# EasyEDA Pro project ProPrj_MSP_M0_G3507_扩展板_2025-09-12.epro, board PCB1
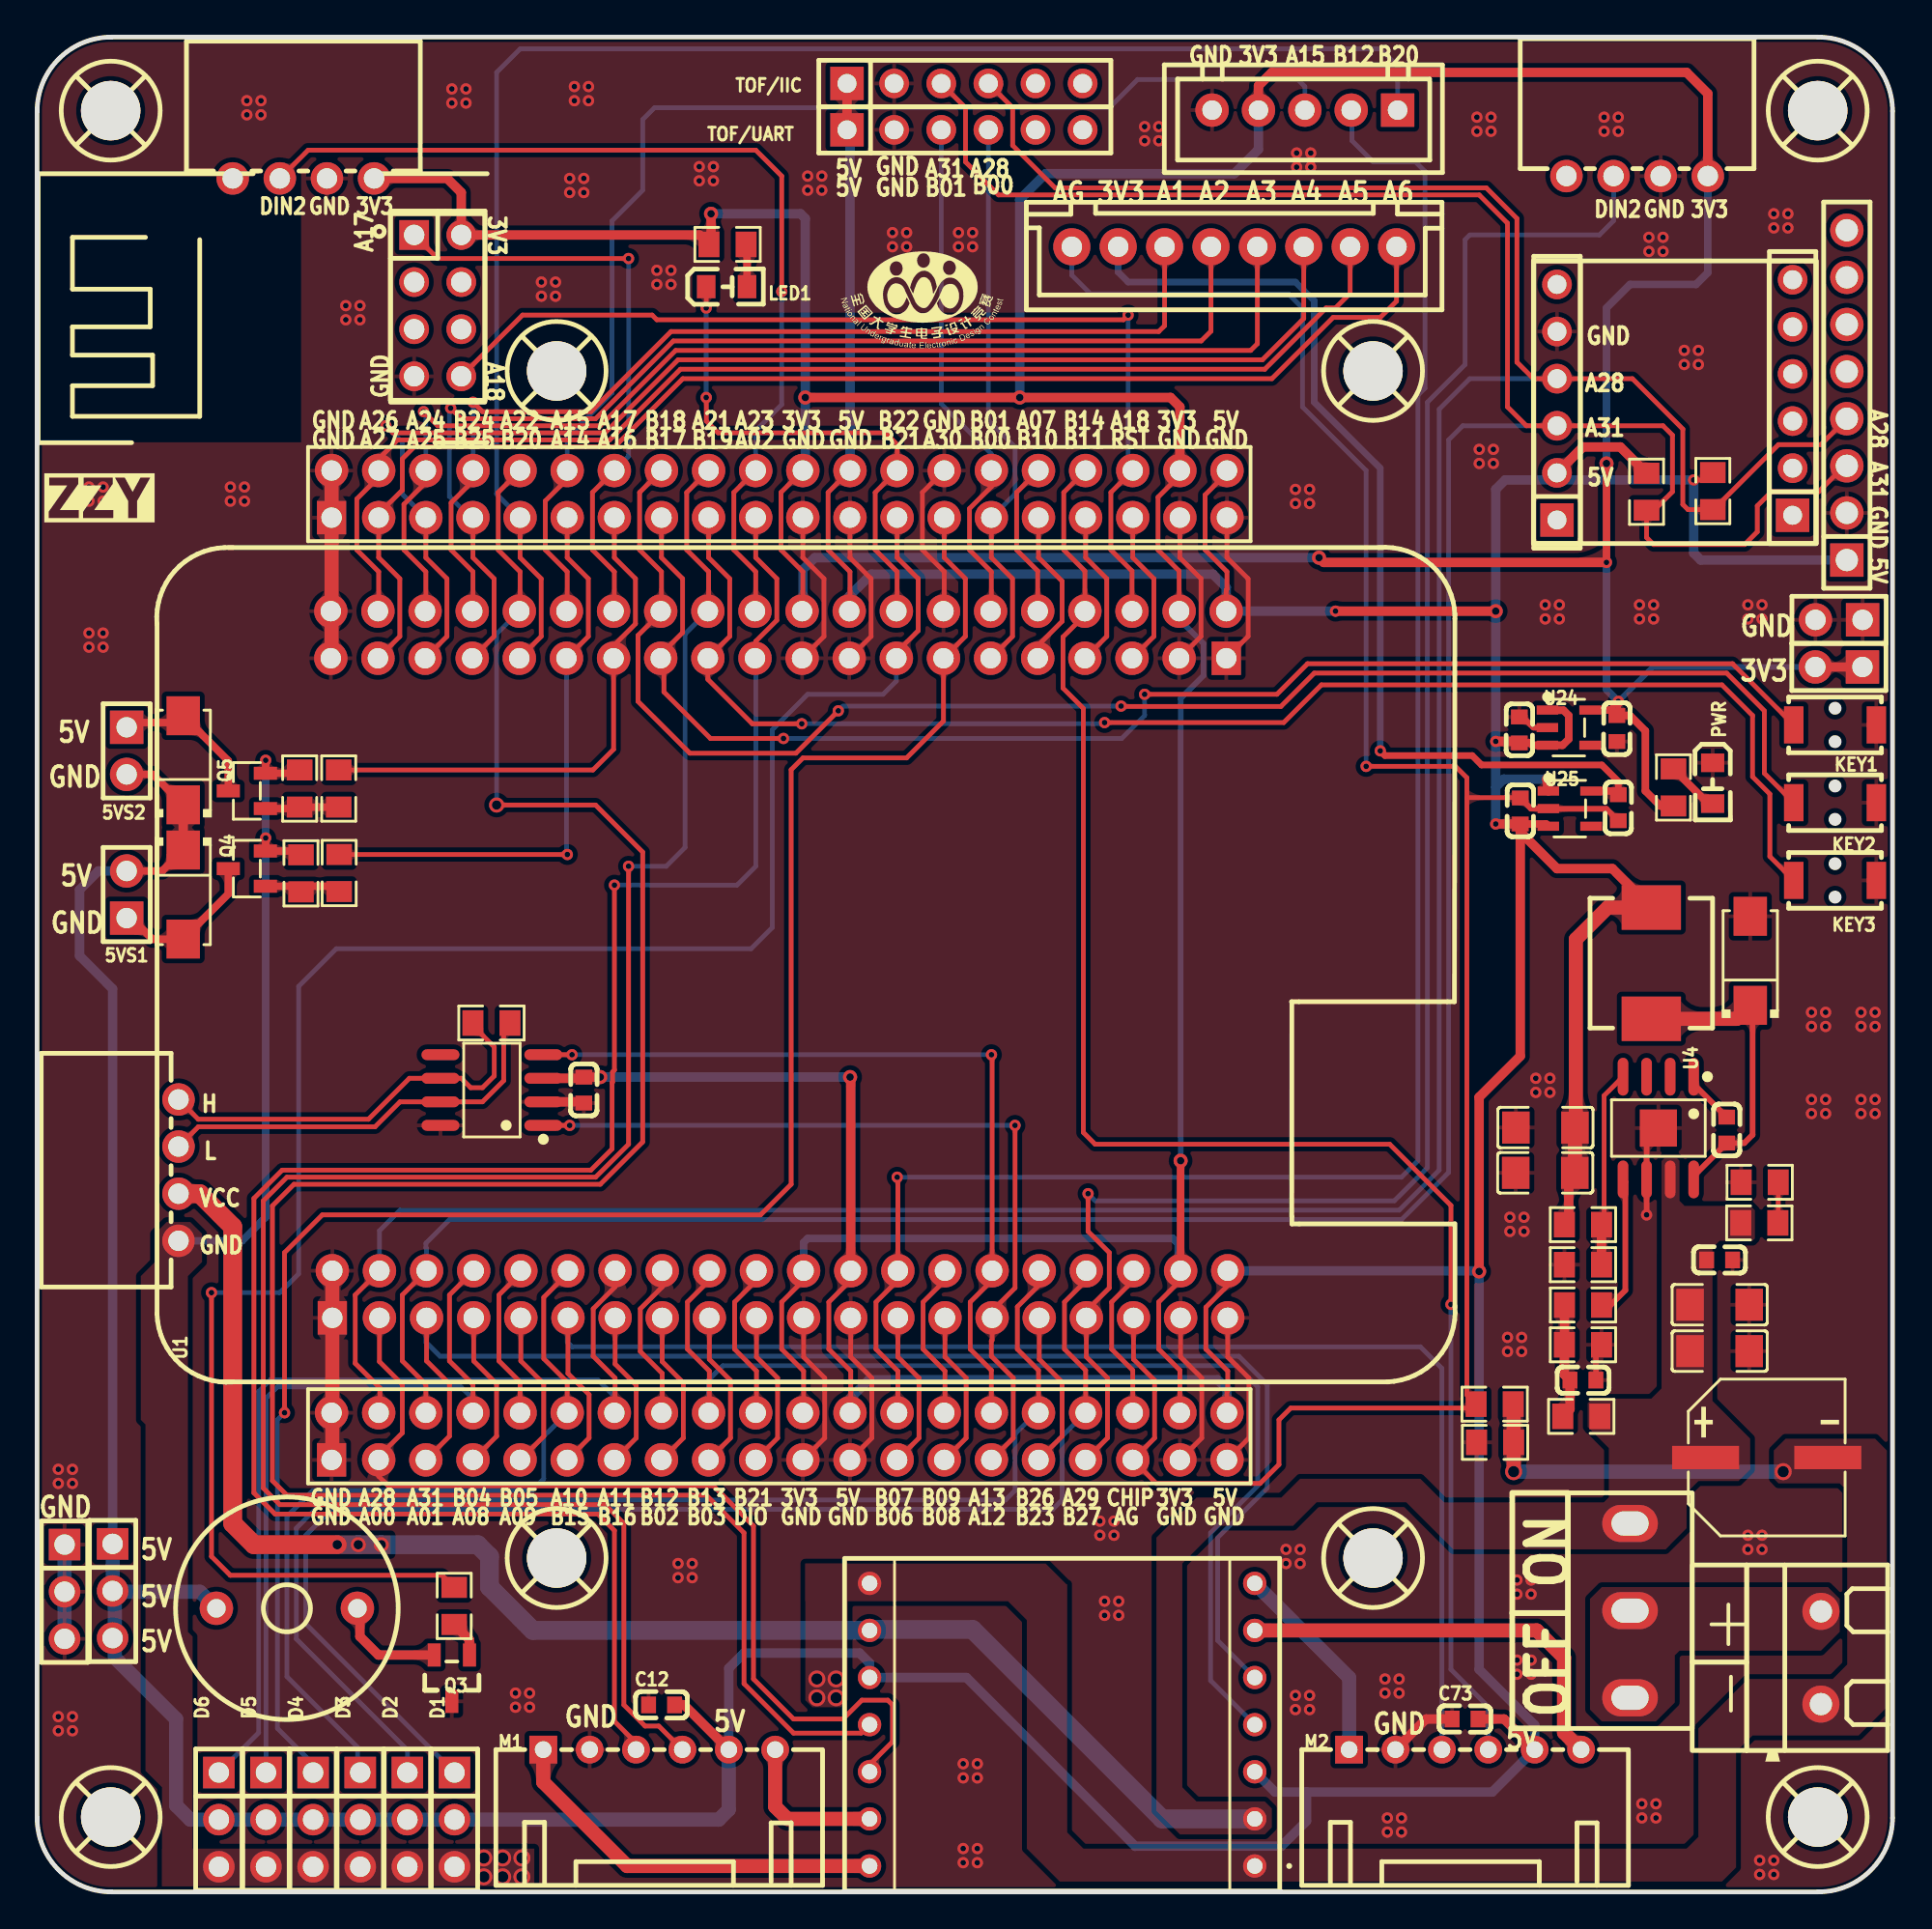
[diagram p4: board, top side]
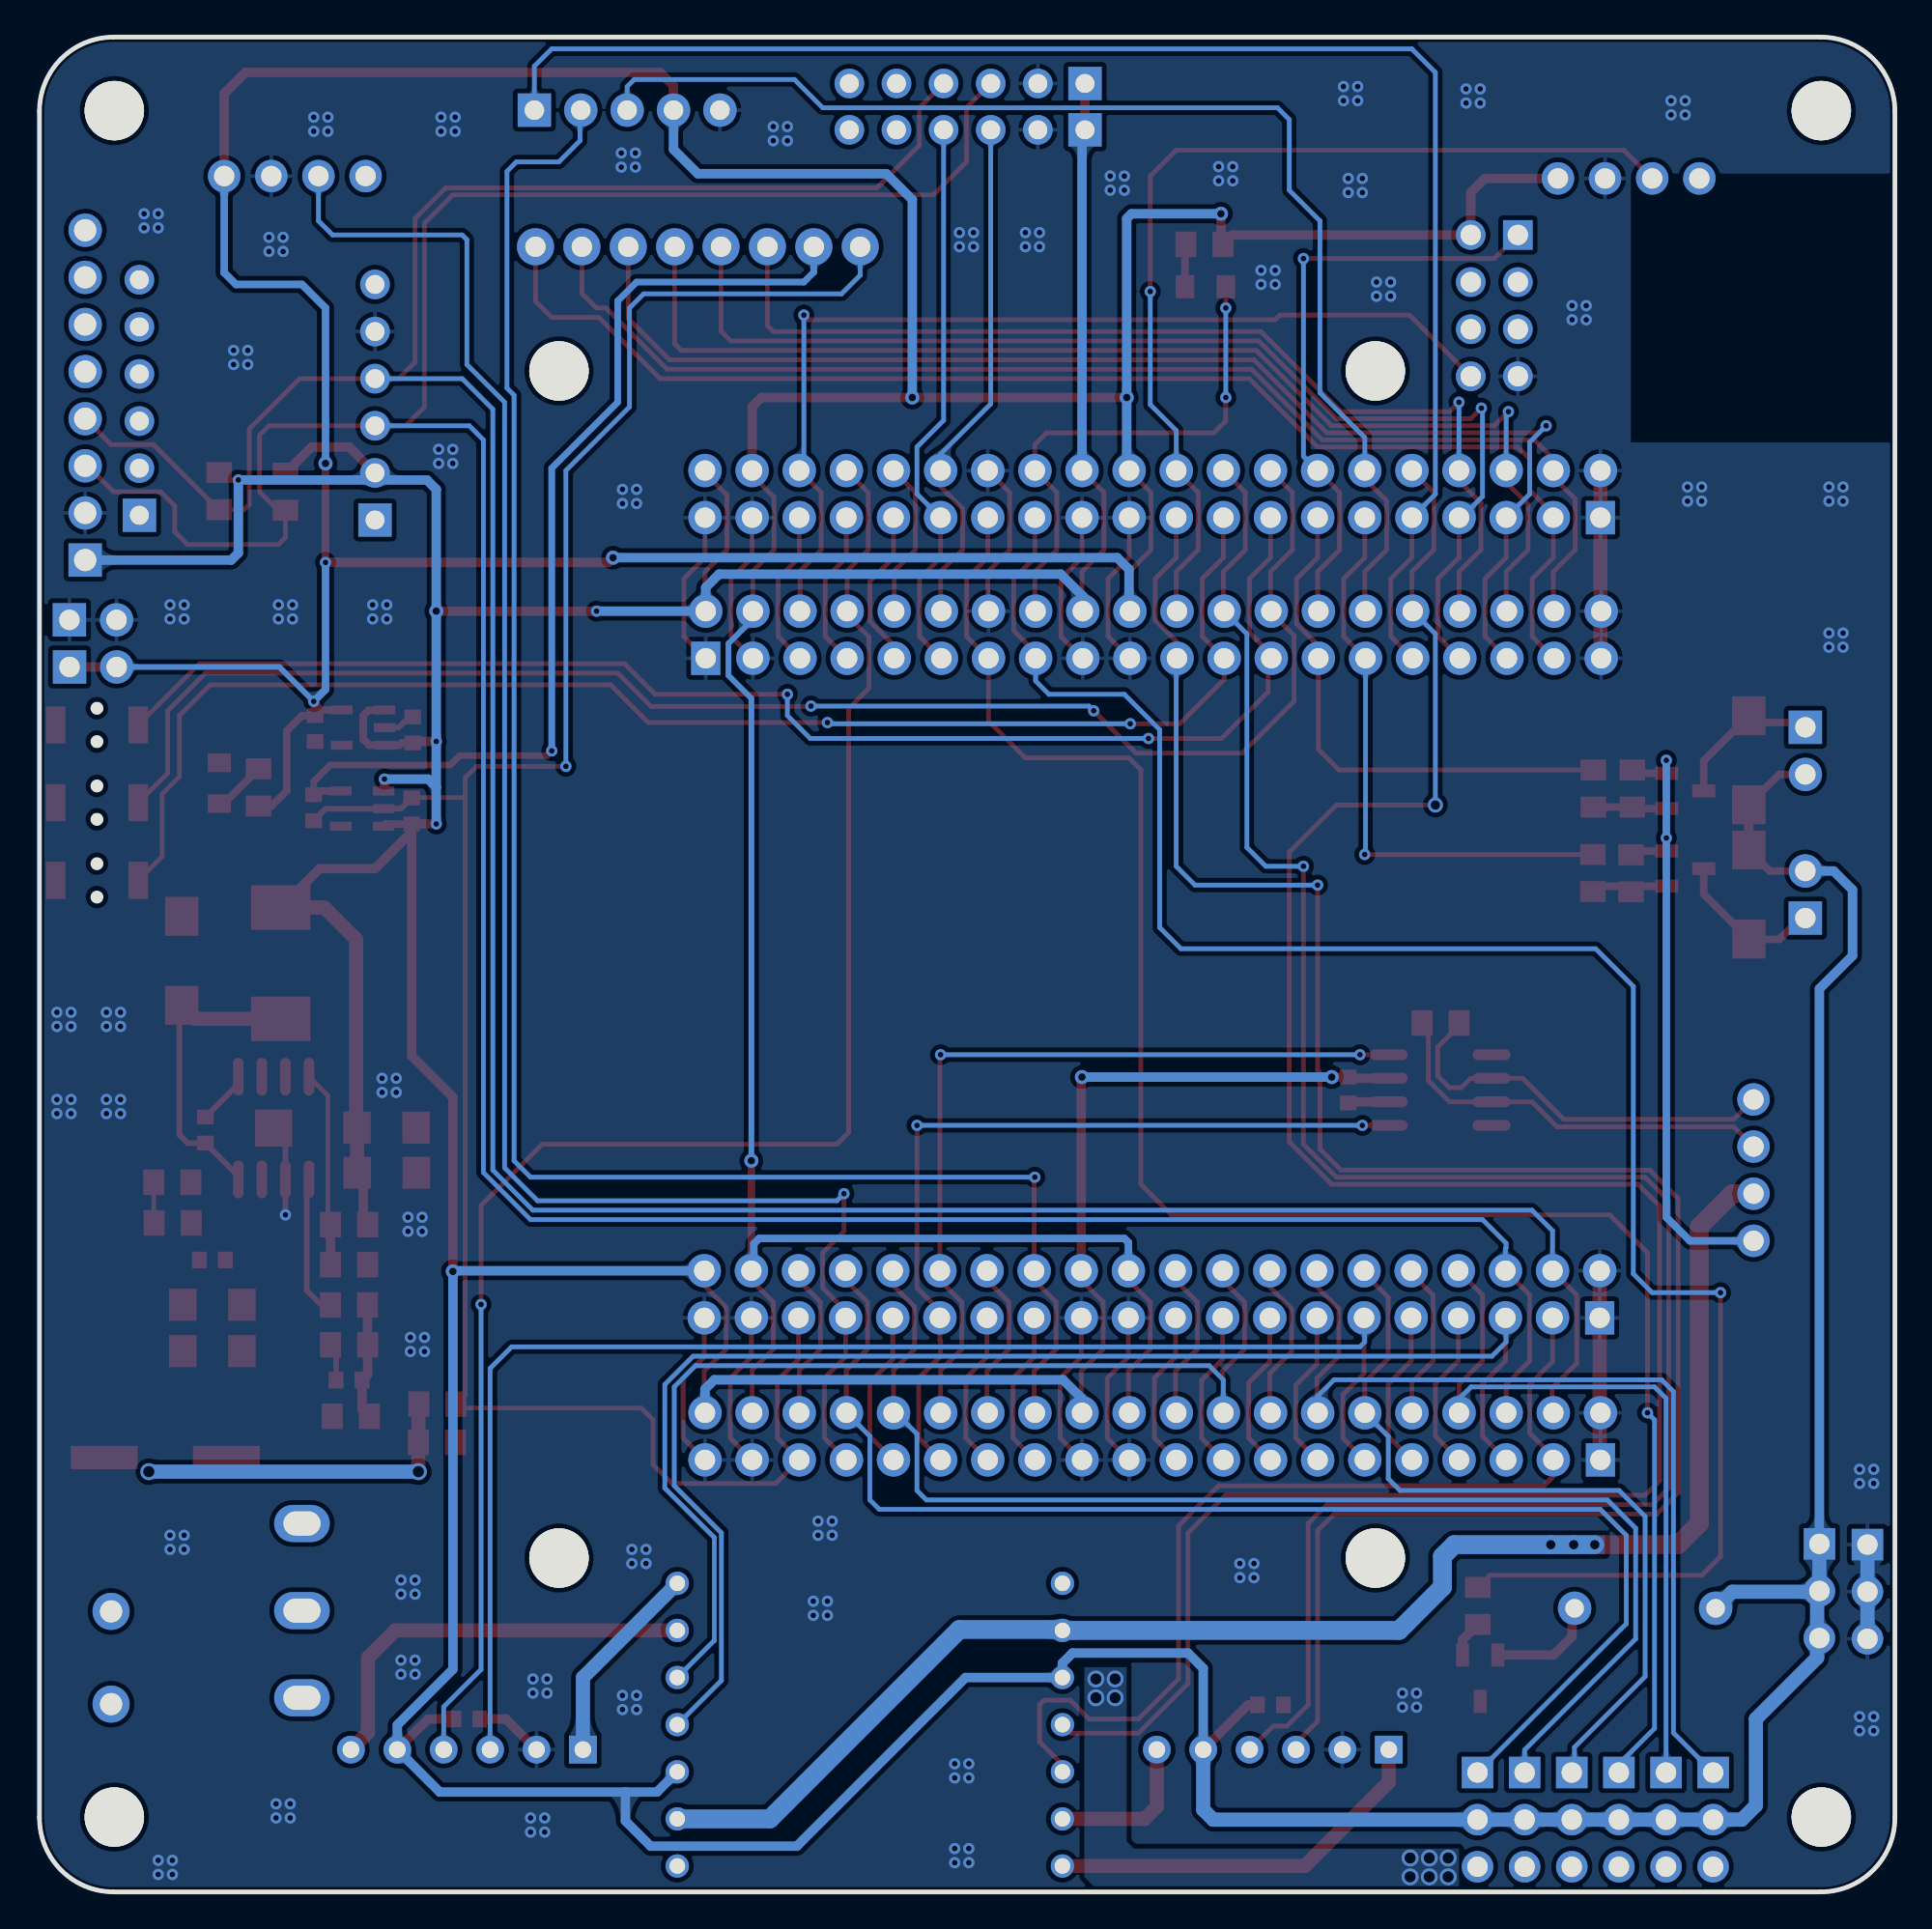
[diagram p5: board, bottom side, seen from below]

Outline 100 x 100 mm; copper layers: Top Layer, Bottom Layer. Coordinates in mm from the lower left corner of the outline.
Outline path: 0,96 0,4 arc(1.17,1.17) 4,0 96,0 arc(98.83,1.17) 100,4 100,96 arc(98.83,98.83) 96,100 4,100 arc(1.17,98.83) 0,96
Stack: Top Layer 0.035mm / Dielectric1 1.51mm FR4 er 4.5 / Bottom Layer 0.035mm

## Design rules (mm)
net CANL: DP1
net CANH: DP1
template: JLCPCB Capability(Two Layers Board)
spacing copperThickness1oz (default): track to track 0.102, other pairs 0.152 to 0.3
spacing copperThickness2oz: track to track 0.203, other pairs 0.152 to 0.3
track width copperThickness1oz (default): min 0.127, default 0.254, max 2.54
track width copperThickness2oz: min 0.203, default 0.254, max 2.54
differential pair differentialPair (default): width min 0.127, default 0.254, max 2.54; gap min 0.152, default 0.152
via viaSize (default): diameter min 0.5, default 0.61, max 10; hole min 0.3, default 0.305, max 6.3

## Placement (name value [footprint] x y rotation side)
5VS1  -  [HDR-TH_2P-P2.54-V-M-1]  4.83 53.77 90 top
5VS2  -  [HDR-TH_2P-P2.54-V-M-1]  4.83 61.52 270 top
BUZZER1  2.4kHz  [BUZ-TH_BD12.0-P7.60-D0.6-FD]  13.46 15.29 0 top
C3  220uF  [CAP-SMD_BD8.0-L8.3-W8.3-LS9.1-FD]  93.22 23.42 0 top
C4  4.7uF  [C0603]  90.68 34.07 0 top
C5  22uF  [C1206]  90.68 31.66 0 top
C6  47uF  [C1206]  90.68 29.16 0 top
C7  47uF  [C1206]  81.28 38.77 0 top
C8  22uF  [C1206]  81.29 41.21 0 top
C9  10nF  [C0603]  91.06 41.07 270 top
C12  100nF  [C0603]  33.66 10.08 0 top
C13  100NF  [C0603]  29.46 43.23 270 top
C32  100nF  [C0603]  83.31 27.59 180 top
C36  1uF  [C0603]  79.88 62.64 270 top
C37  1uF  [C0603]  85.14 62.72 90 top
C49  1uF  [C0603]  79.94 58.28 270 top
C50  1uF  [C0603]  85.22 58.45 90 top
C73  100nF  [C0603]  76.96 9.32 0 top
CN3  HWXJ  [CONN-TH_8P-P2.50-XH2.54-8P]  64.52 88.7 0 top
CN6  CAN  [CONN-TH_XH-4AW]  7.62 38.91 270 top
CN7  CCD  [CONN-TH_5P-P2.50_XH-5A]  68.33 96.06 180 top
CN9  L_DIN  [CONN-TH_XH-4AW]  14.35 92.38 180 top
CN10  R_DIN  [CONN-TH_XH-4AW]  86.23 92.51 180 top
D1  PZ254V-11-03P  [HDR-TH_3P-P2.54-V-M]  22.5 3.9 270 top
D2  PZ254V-11-03P  [HDR-TH_3P-P2.54-V-M]  19.95 3.9 270 top
D3  PZ254V-11-03P  [HDR-TH_3P-P2.54-V-M]  17.42 3.9 270 top
D4  PZ254V-11-03P  [HDR-TH_3P-P2.54-V-M]  14.88 3.9 270 top
D5  PZ254V-11-03P  [HDR-TH_3P-P2.54-V-M]  12.33 3.9 270 top
D6  PZ254V-11-03P  [HDR-TH_3P-P2.54-V-M]  9.8 3.9 270 top
ESP01S1  -  [HDR-TH_8P-P2.54-V-F-R2-C4-S2.54-1]  21.59 85.52 270 top
H6  -  [HDR-TH_6P-P2.54-V-F]  94.62 80.57 90 top
H20  -  [HDR-TH_8P-P2.54-V-F-1]  97.54 80.7 90 top
H21  -  [HDR-TH_3P-P2.54-V-M]  4.07 16.22 270 top
H22  -  [HDR-TH_2P-P2.54-V-M-1]  97.11 66.04 180 top
H24  -  [HDR-TH_2P-P2.54-V-M-1]  97.12 68.58 180 top
H25  -  [HDR-TH_3P-P2.54-V-M]  1.48 16.19 270 top
JY901I2C1  -  [HDR-TH_6P-P2.54-V-F]  81.91 80.31 90 top
KEY1  ZX-QC34-2TPDZ  [KEY-SMD_L3.9-W3.0-LS5.0-EH]  96.9 62.92 0 top
KEY2  ZX-QC34-2TPDZ  [KEY-SMD_L3.9-W3.0-LS5.0-EH]  96.9 58.72 0 top
KEY3  ZX-QC34-2TPDZ  [KEY-SMD_L3.9-W3.0-LS5.0-EH]  96.9 54.53 0 top
LED1  -  [LED_0805]  37.21 86.54 0 top
M1  ZX-HA2.54-6PWZ  [CONN-TH_6P-P2.50_ZX-HA2.54-6PWZ-Y]  33.53 7.67 0 top
M2  ZX-HA2.54-6PWZ  [CONN-TH_6P-P2.50_ZX-HA2.54-6PWZ-Y]  76.96 7.67 0 top
P1  KF301-2P接线端子  [CONN-TH_XY301V-A-5.0-2P]  96.14 12.62 270 top
PWR  -  [LED_0805]  90.3 59.72 270 top
Q3  -  [S8550P_SOT]  22.35 11.48 90 top
Q4  AO3400A  [SOT-23-3_L2.9-W1.3-P1.90-LS2.4-BR]  11.3 55.17 0 top
Q5  AO3400A  [SOT-23-3_L2.9-W1.3-P1.90-LS2.4-BR]  11.3 59.36 0 top
R1  10K  [R0805]  92.82 36.07 0 top
R5  1K  [R0805]  92.84 38.26 0 top
R6  10K  [R0805]  83.31 35.97 180 top
R7  3.3K  [R0805]  83.31 33.82 0 top
R8  120R  [R0805]  24.49 46.84 0 top
R16  6.8KNTC  [R0805]  83.31 29.5 180 top
R17  10K  [R0805]  83.22 25.64 0 top
R18  0R  [R0805]  83.32 31.64 0 top
R19  0R  [R0805]  78.58 24.24 0 top
R20  3.3K  [R0805]  86.74 75.49 90 top
R21  3.3K  [R0805]  90.31 75.52 90 top
R23  1K  [R0805]  22.48 15.42 270 top
R24  6.8K  [R0805]  88.19 59.55 270 top
R89  0R  [R0805]  78.56 26.3 0 top
R90  22R  [R0805]  16.28 54.93 90 top
R91  10K  [R0805]  14.22 54.92 90 top
R92  22R  [R0805]  16.26 59.49 90 top
R93  10K  [R0805]  14.15 59.49 90 top
R94  6.8K  [R0805]  37.21 88.82 180 top
SCREW1  -  [M3螺丝]  3.97 4.03 270 top
SCREW2  -  [M3螺丝]  95.97 96.03 270 top
SCREW3  -  [M3螺丝]  3.97 96.03 270 top
SCREW4  -  [M3螺丝]  95.97 4.03 270 top
SCREW5  -  [M3螺丝]  72 18 0 top
SCREW6  -  [M3螺丝]  72 82 0 top
SCREW7  -  [M3螺丝]  28 82 0 top
SCREW8  -  [M3螺丝]  28 18 0 top
SW1  SS-12D10L5  [SW-TH_SS-12D10L5]  85.85 15.16 90 top
TOF/IIC  -  [HDR-TH_6P-P2.54-V-F]  50 97.5 0 top
TOF/UART  -  [HDR-TH_6P-P2.54-V-F]  50 95 0 top
U1  LCKFB-TMX-MSPM0G3507  [COMM-TH_LCKFB-TMX-MSPM0G3507]  40 50 90 top
U4  RT8289GSP  [SOIC-8_L5.0-W4.0-P1.27-LS6.0-BL-EP2.0]  87.38 41.18 180 top
U5  TJA1050T  [SOIC-8_L4.9-W3.9-P1.27-LS6.0-BL]  24.51 43.23 90 top
U24  RT9013-33GB  [SOT-23-5_L3.0-W1.7-P0.95-LS2.8-BL]  82.55 62.77 270 top
U25  RT9013-33GB  [SOT-23-5_L3.0-W1.7-P0.95-LS2.8-BL]  82.6 58.4 270 top
U41  AT8236  [AT8236-Dual-Module]  55.25 9.07 180 top
U48  -  [jy901]  95.88 72.57 180 top
U50  -  [esp01s]  24.26 92.63 270 top
U51  10uH  [IND-SMD_L7.0-W6.6]  87 50.07 270 top
U52  SS54  [SMA_L4.2-W2.6-LS5.1-RD]  7.87 53.77 270 top
U53  SS54  [SMA_L4.2-W2.6-LS5.1-RD]  92.33 50.2 90 top
U54  SS54  [SMA_L4.2-W2.6-LS5.1-RD]  7.87 61.01 90 top
U55  left  [HDR-TH_40P-P2.54-V-M-R2-C20-S2.54]  40 24.56 0 top
U56  right  [HDR-TH_40P-P2.54-V-M-R2-C20-S2.54]  40 75.36 0 top

## Footprints (pads in the part's own frame, mm; a bottom-side part is the same pattern mirrored in y, then rotated)
AT8236-Dual-Module
  round 1.26 hole 0.84: 1(-10.38,7.671) 2(-10.38,5.131) 3(-10.38,2.591) 4(-10.38,0.051) 5(-10.38,-2.489) 6(-10.38,-5.029) 7(-10.38,-7.569) 8(10.38,7.671) 9(10.38,5.131) 10(10.38,2.591) 11(10.38,0.051) 12(10.38,-2.489) 13(10.38,-5.029) 14(10.38,-7.569)
BUZ-TH_BD12.0-P7.60-D0.6-FD
  round 1.8 hole 1: 1(-3.8,0) 2(3.8,0)
C0603
  rect 0.8x0.9 smd: 1(-0.7,0) 2(0.7,0)
C1206
  rect 1.485x1.728 smd: 1(-1.593,0) 2(1.593,0)
CAP-SMD_BD8.0-L8.3-W8.3-LS9.1-FD
  rect 3.61x1.26 smd: 1(-3.295,0) 2(3.295,0)
COMM-TH_LCKFB-TMX-MSPM0G3507
  rect 1.8x1.575 hole 1.1: 1(-19.05,24.09) 41(16.51,-24.09)
  round 1.8 hole 1.1: 2(-16.51,24.09) 3(-19.05,21.549) 4(-16.51,21.549) 5(-19.05,19.009) 6(-16.51,19.009) 7(-19.05,16.47) 8(-16.51,16.47) 9(-19.05,13.93) 10(-16.51,13.93) 11(-19.05,11.389) 12(-16.51,11.389) 13(-19.05,8.85) 14(-16.51,8.85) 15(-19.05,6.309) 16(-16.51,6.309) 17(-19.05,3.769) 18(-16.51,3.769) 19(-19.05,1.23) 20(-16.51,1.23) 21(-19.05,-1.31) 22(-16.51,-1.31) 23(-19.05,-3.85) 24(-16.51,-3.85) 25(-19.05,-6.391) 26(-16.51,-6.391) 27(-19.05,-8.931) 28(-16.51,-8.931) 29(-19.05,-11.47) 30(-16.51,-11.47) 31(-19.05,-14.011) 32(-16.51,-14.011) 33(-19.05,-16.55) 34(-16.51,-16.55) 35(-19.05,-19.09) 36(-16.51,-19.09) 37(-19.05,-21.631) 38(-16.51,-21.631) 39(-19.05,-24.171) 40(-16.51,-24.171) 42(19.05,-24.09) 43(16.51,-21.549) 44(19.05,-21.549) 45(16.51,-19.009) 46(19.05,-19.009) 47(16.51,-16.47) 48(19.05,-16.47) 49(16.51,-13.93) 50(19.05,-13.93) 51(16.51,-11.389) 52(19.05,-11.389) 53(16.51,-8.85) 54(19.05,-8.85) 55(16.51,-6.309) 56(19.05,-6.309) 57(16.51,-3.769) 58(19.05,-3.769) 59(16.51,-1.23) 60(19.05,-1.23) 61(16.51,1.31) 62(19.05,1.31) 63(16.51,3.85) 64(19.05,3.85) 65(16.51,6.391) 66(19.05,6.391) 67(16.51,8.931) 68(19.05,8.931) 69(16.51,11.47) 70(19.05,11.47) 71(16.51,14.011) 72(19.05,14.011) 73(16.51,16.55) 74(19.05,16.55) 75(16.51,19.09) 76(19.05,19.09) 77(16.51,21.631) 78(19.05,21.631) 79(16.51,24.171) 80(19.05,24.171)
CONN-TH_5P-P2.50_XH-5A
  rect 1.8x1.8 hole 1.05: 1(-5,0)
  round 1.8 hole 1.05: 2(-2.498,0) 3(0.002,0) 4(2.501,0) 5(5,0)
CONN-TH_6P-P2.50_ZX-HA2.54-6PWZ-Y
  rect 1.5x1.5 hole 0.9: 1(-6.25,0)
  round 1.5 hole 0.9: 2(-3.75,0) 3(-1.25,0) 4(1.25,0) 5(3.75,0) 6(6.25,0)
CONN-TH_8P-P2.50-XH2.54-8P
  round 2 hole 1.1: 1(8.75,0) 2(6.25,0) 3(3.75,0) 4(1.25,0) 5(-1.25,0) 6(-3.75,0) 7(-6.25,0) 8(-8.75,0)
CONN-TH_XH-4AW
  round 1.75 hole 1.1: 1(-3.81,0) 2(-1.27,0) 3(1.27,0) 4(3.81,0)
CONN-TH_XY301V-A-5.0-2P
  round 2 hole 1.2: 1(-2.5,0) 2(2.5,0)
HDR-TH_2P-P2.54-V-M-1
  rect 1.8x1.8 hole 1.1: 1(-1.27,0)
  round 1.8 hole 1.1: 2(1.27,0)
HDR-TH_3P-P2.54-V-M
  rect 1.7x1.7 hole 1.1: 1(-2.54,0)
  round 1.7 hole 1.1: 2(0,0) 3(2.54,0)
HDR-TH_6P-P2.54-V-F
  rect 1.8x1.8 hole 1.02: 1(-6.35,0)
  round 1.6 hole 1.02: 2(-3.81,0) 3(-1.27,0) 4(1.27,0) 5(3.81,0) 6(6.35,0)
HDR-TH_8P-P2.54-V-F-1
  rect 1.8x1.8 hole 1.2: 1(-8.89,0)
  round 1.8 hole 1.2: 2(-6.35,0) 3(-3.81,0) 4(-1.27,0) 5(1.27,0) 6(3.81,0) 7(6.35,0) 8(8.89,0)
HDR-TH_8P-P2.54-V-F-R2-C4-S2.54-1
  rect 1.6x1.6 hole 1.1: 1(-3.81,-1.27)
  round 1.6 hole 1.1: 2(-3.81,1.27) 3(-1.27,-1.27) 4(-1.27,1.27) 5(1.27,-1.27) 6(1.27,1.27) 7(3.81,-1.27) 8(3.81,1.27)
HDR-TH_40P-P2.54-V-M-R2-C20-S2.54
  rect 1.575x1.8 hole 1.1: 1(-24.13,-1.27)
  round 1.8 hole 1.1: 2(-24.13,1.27) 3(-21.59,-1.27) 4(-21.59,1.27) 5(-19.05,-1.27) 6(-19.05,1.27) 7(-16.51,-1.27) 8(-16.51,1.27) 9(-13.97,-1.27) 10(-13.97,1.27) 11(-11.43,-1.27) 12(-11.43,1.27) 13(-8.89,-1.27) 14(-8.89,1.27) 15(-6.35,-1.27) 16(-6.35,1.27) 17(-3.81,-1.27) 18(-3.81,1.27) 19(-1.27,-1.27) 20(-1.27,1.27) 21(1.27,-1.27) 22(1.27,1.27) 23(3.81,-1.27) 24(3.81,1.27) 25(6.35,-1.27) 26(6.35,1.27) 27(8.89,-1.27) 28(8.89,1.27) 29(11.43,-1.27) 30(11.43,1.27) 31(13.97,-1.27) 32(13.97,1.27) 33(16.51,-1.27) 34(16.51,1.27) 35(19.05,-1.27) 36(19.05,1.27) 37(21.59,-1.27) 38(21.59,1.27) 39(24.13,-1.27) 40(24.13,1.27)
IND-SMD_L7.0-W6.6
  rect 2.4x3.2 smd: 1(-3,0) 2(3,0)
KEY-SMD_L3.9-W3.0-LS5.0-EH
  rect 1.05x2 smd: 1(-2.225,0) 2(2.225,0)
LED_0805
  rect 1x1.25 smd: 1(-1.15,0.005) 2(1.05,0.005)
M3螺丝
  round 3.2 hole 3.2: 1(0,0)
R0805
  rect 1.133x1.377 smd: 1(-1,0) 2(1,0)
S8550P_SOT
  rect 1.25x0.701 smd: 1(1.292,-0.95) 2(1.292,0.95) 3(-1.208,0)
SMA_L4.2-W2.6-LS5.1-RD
  rect 2.1x1.8 smd: 1(-2.4,0) 2(2.4,0)
SOIC-8_L4.9-W3.9-P1.27-LS6.0-BL
  oval 0.588x2.045 smd: 1(-1.905,-2.772) 2(-0.635,-2.772) 3(0.635,-2.772) 4(1.905,-2.772) 5(1.905,2.772) 6(0.635,2.772) 7(-0.635,2.772) 8(-1.905,2.772)
SOIC-8_L5.0-W4.0-P1.27-LS6.0-BL-EP2.0
  oval 0.574x2.038 smd: 1(-1.905,-2.769) 2(-0.635,-2.769) 3(0.635,-2.769) 4(1.905,-2.769) 5(1.905,2.769) 6(0.635,2.769) 7(-0.635,2.769) 8(-1.905,2.769)
  rect 2x2 smd: 9(0,0)
SOT-23-3_L2.9-W1.3-P1.90-LS2.4-BR
  rect 1.25x0.7 smd: 1(1,-0.95) 2(1,0.95) 3(-1,0)
SOT-23-5_L3.0-W1.7-P0.95-LS2.8-BL
  rect 0.49x1.157 smd: 1(-0.95,-1.153) 2(0,-1.153) 3(0.95,-1.153)
  rect 0.49x1.175 smd: 4(0.95,1.153) 5(-0.95,1.153)
SW-TH_SS-12D10L5
  oval 2x3 hole 1.3x2: 1(-4.7,0) 2(0,0) 3(4.7,0)

## Nets
As in the schematic, except:
GND: C4.2 C5.2 C6.2 C7.1 C8.1 C12.1 C13.2 C32.1 C36.1 C37.1 C73.1 CN7.5 CN9.2 CN10.2 ESP01S1.7 H20.2 H24.1 H24.2 H25.1 H25.2 H25.3 JY901I2C1.5 KEY1.2 KEY2.2 KEY3.2 M1.2 M2.2 PWR.1 Q3.3 R5.1 R7.1 R16.1 R19.1 TOF/IIC.2 TOF/UART.2 U1.1 U1.2 U1.21 U1.23 U1.37 U1.39 U1.41 U1.43 U1.54 U1.57 U1.59 U1.79 U1.80 U4.6 U4.9 U5.2 U5.8 U24.2 U53.2 U55.1 U55.2 U55.21 U55.23 U55.37 U55.39 U56.1 U56.2 U56.21 U56.23 U56.28 U56.37 U56.39
PGND: C3.2 CN6.4 D1.3 D2.3 D3.3 D4.3 D5.3 D6.3 P1.2 Q4.2 Q5.2 R19.2 R89.2 R91.2 R93.2 U41.1 U41.14

Pads without a net: CN9 4; CN10 4; ESP01S1 3 4 5 6; H6 1 2 3 4 5 6; H20 5 6 7 8; JY901I2C1 1 6; SCREW1 1; SCREW2 1; SCREW3 1; SCREW4 1; SCREW5 1; SCREW6 1; SCREW7 1; SCREW8 1; TOF/IIC 5 6; TOF/UART 5 6; U4 2 3; U5 5; U24 4; U25 4

## Via types
v1: diameter 0.61, hole 0.305, Top Layer to Bottom Layer, 239 vias
v2: diameter 0.813, hole 0.508, Top Layer to Bottom Layer, 4 vias
v3: diameter 0.762, hole 0.406, Top Layer to Bottom Layer, 10 vias
v4: diameter 0.914, hole 0.61, Top Layer to Bottom Layer, 12 vias

## Routing (per net, layer and track width the routed paths; a pad name or vN(x,y) marks a point on that pad's centre or on a via; arc(x,y) is an arc through that point)
3V3: length 319.6
  Top Layer w0.254: U56.38 61.59,76.37 60.41,75.19 60.41,72.36 61.55,71.22 U1.44 ; U1.22 41.31,32.98 40.13,31.8 40.13,29.26 41.31,28.08 41.31,26.23 41.27,26.19 U55.22 ; U1.38 61.63,32.98 60.45,31.8 60.45,29.26 61.59,28.12 U55.38 ; U1.60 41.27,69.09 41.27,71.18 40.09,72.36 40.09,75.45 U56.22
  Top Layer w0.305: C37.2 85.22,63.5 v1(85.22,64.19) 84.75,63.72
  Top Layer w0.406: v3(84.58,77.01) v1(84.58,71.68) ; U24.5 84.75,63.72 ; R24.2 87.49,58.55 86.68,59.36 86.68,62.6 85.85,63.42 C37.2 ; U1.38 v3(61.63,39.42)
  Top Layer w0.508: CN10.1 90.04,96.95 88.9,98.09 66.55,98.09 65.83,97.37 CN7.4 ; v1(84.58,71.68) 69.34,71.68 v3(69.09,71.93) ; H22.2 H22.1 ; U56.38 61.59,80.07 61.09,80.57 v3(52.96,80.57) v3(41.4,80.57) ; CN9.1 22.1,92.38 22.86,91.62 ESP01S1.2 35.7,89.33 R94.2 36.32,88.94 v3(36.32,90.47)
  Bottom Layer w0.305: v3(61.63,39.42) 61.63,64.35 62.87,65.58 62.87,67.3 61.63,68.54 61.63,68.97 U1.44 ; v1(85.22,64.19) 87.07,66.04 H22.2 ; 61.61,39.4 61.72,39.29
  Bottom Layer w0.406: v3(84.58,77.01) 84.58,85.39 85.85,86.67 89.41,86.67 90.04,87.3 CN10.1 ; v1(85.22,64.19) 84.58,64.82 v1(84.58,71.68) ; U1.38 61.5,33.62 61.5,34.94 61.21,35.23 41.53,35.23 41.31,35.01 U1.22
  Bottom Layer w0.508: v3(52.96,80.57) 52.96,91.24 54.36,92.63 64.52,92.63 65.83,93.94 CN7.4 ; U56.22 41.4,76.76 v3(41.4,80.57) 41.4,90.22 41.15,90.47 v3(36.32,90.47) ; U1.60 41.28,69.1 41.28,71.3 41.91,71.93 v3(69.09,71.93)
5V_SW1: length 31.4
  Top Layer w0.254: U56.11 28.57,71.94 29.71,70.8 29.71,67.69 U1.69 ; R90.2 v1(28.57,55.93)
  Bottom Layer w0.254: v1(28.57,55.93) 28.53,55.98 U1.69
5V_SW2: length 28.7
  Top Layer w0.254: R92.2 29.96,60.49 31.07,61.6 U1.67 31.07,67.19 32.25,68.37 32.25,70.8 31.11,71.94 U56.13
+5V: length 470.4
  Top Layer w0.254: v1(89.28,76.12) 89.91,76.12 R21.2 ; U1.58 43.81,69.09 43.81,71.18 42.63,72.36 42.63,75.45 U56.24 ; U1.40 64.17,32.7 62.99,31.52 62.99,29.26 64.17,28.08 64.17,27.03 64.13,26.99 U55.40 ; 64.13,76.5 62.95,75.32 62.95,72.36 64.13,71.18 64.13,70.24 64.09,70.2 U1.42 ; U55.24 43.85,25.87 43.85,28.08 42.67,29.26 42.67,31.8 43.85,32.98 U1.24
  Top Layer w0.406: 7.87,58.61 6.24,60.25 4.83,60.25 ; U24.1 81.41,63.71 82.26,63.71 82.55,63.42 82.55,62.15 82.22,61.82 U24.3 80.6,61.82 80.47,61.94 C36.2 ; C49.2 81.33,57.58 U25.3 ; U52.1 6.74,55.04 5VS1.2
  Top Layer w0.508: R6.2 82.55,36.21 82.55,38.44 C7.2 ; C12.2 34.87,10.08 M1.5 ; U51.1 84.9,55.17 81.91,55.17 79.94,57.15 ; JY901I2C1.2 83.31,77.9 85.33,77.9 R20.2 ; 7.87,58.61 7.87,56.17 U52.1 ; v3(43.81,43.93) 43.85,43.9 U1.24 ; C73.2 79.06,9.32 M2.5 ; v3(30.35,43.93) C13.1 29.4,43.87 U5.3 ; 79.94,57.15 C49.2 v1(78.61,57.58) ; 79.94,57.15 79.94,45.06 77.72,42.84 v3(77.72,33.45) ; TOF/UART.1 TOF/IIC.1 ; C36.2 79.8,62.03 v1(78.61,62.03) ; v3(78.61,69.05) v1(69.98,69.05) ; U25.1 81.41,59.4 v1(81.41,60)
  Top Layer w0.762: U51.1 84.64,53.07 82.93,51.36 82.93,41.26 C8.2 82.88,38.78 C7.2 ; U56.40 64.13,76.5
  Bottom Layer w0.508: v1(78.61,57.58) 78.61,59.57 ; 78.61,59.57 v1(78.61,62.03) v3(78.61,69.05) 78.61,75.62 79.12,76.12 81.53,76.12 JY901I2C1.2 82.3,76.12 v1(89.28,76.12) 89.28,72.19 89.66,71.81 H20.1 ; 78.61,59.57 79.04,60 v1(81.41,60) ; U55.40 64.13,27.11 63.63,27.61 44.83,27.61 43.81,26.59 U55.24 ; U56.24 43.81,94.84 TOF/UART.1 ; 68.42,5.38 78.43,5.38 M2.5 80.71,9 77.72,12 v3(77.72,33.45) 77.68,33.49 U1.40 ; 68.42,5.38 66.72,5.38 U41.3 ; 68.42,5.38 68.42,3.82 67.06,2.46 59.18,2.46 50.09,11.56 44.87,11.56 44.87,12.34 44.32,12.88 38.1,12.88 37.28,12.06 M1.5 ; v3(30.35,43.93) v3(43.81,43.93) ; U1.58 43.77,69.86 44.96,71.04 63.37,71.04 64.09,70.33 U1.42 v1(69.98,69.05) ; 5VS1.2 3.3,55.04 2.29,54.03 2.29,50.47 4.07,48.69 H21.1
  Bottom Layer w0.762: BUZZER1.1 8.77,16.18 4.19,16.18 ; H21.1 H21.2 4.11,16.18 4.19,16.18 ; 4.19,16.18 4.19,12.62 7.49,9.32 7.49,4.66 8.25,3.9 D6.2 D5.2 D4.2 D3.2 D2.2 D1.2 36.74,3.9 37.28,4.44 M1.5
A3V3: length 54.1
  Top Layer w0.355: v1(72.39,61.52) 72.64,61.27 77.34,61.27 77.85,60.76 84.33,60.76 85.22,59.87 C50.2
  Top Layer w0.406: 83.76,59.35 85.02,59.35 C50.2
  Bottom Layer w0.355: v1(72.39,61.52) 72.39,76.76 68.83,80.31 68.83,85.78 67.82,86.79 58.8,86.79 58.27,87.33 CN3.7
AGND: length 120
  Top Layer w0.254: 77.06,58.97 77.06,26.79 R89.1 77.35,26.09 67.56,26.09 66.93,25.45 66.93,23.04 65.91,22.02 60.32,22.02 U55.35 60.23,24.47 60.23,27.58 59.09,28.72 U1.35 ; 77.06,58.97 77.06,60.07 76.44,60.68 v1(71.63,60.68) ; 77.06,58.97 77.08,59 79.92,59 C49.1
  Top Layer w0.305: C50.1 84.58,58.39 81.46,58.39 U25.2 80.51,58.4 C49.1
  Bottom Layer w0.254: CN3.8 55.77,87.16 56.77,86.16 67.44,86.16 68.2,85.39 68.2,80.06 71.63,76.63 v1(71.63,60.68)
GND: length 116.6
  Top Layer w0.254: U55.37 62.77,24.47 62.77,27.71 61.63,28.84 U1.37 ; U1.59 42.41,67.69 42.41,70.8 41.27,71.94 U56.21 ; U55.23 44.99,24.47 44.99,27.71 43.85,28.84 U1.23 ; U55.21 42.45,24.47 42.45,27.71 41.31,28.84 U1.21 ; U56.28 47.71,75.45 47.71,72.36 48.89,71.18 48.89,69.09 U1.54 ; U1.39 64.17,28.84 65.31,27.71 65.31,24.47 U55.39 ; U56.23 43.81,71.94 44.95,70.8 44.95,67.69 U1.57 ; U1.41 65.27,67.69 65.27,70.8 64.13,71.94 U56.39 ; U1.43 62.73,67.69 62.73,70.8 61.59,71.94 U56.37
  Top Layer w0.305: v1(86.74,36.5) U4.6 86.74,40.55 86.88,40.68 ; U24.2 80.65,62.77 80.07,63.34 C36.1 ; C32.1 84.01,29.2 R16.1
  Top Layer w0.508: 29.46,42.53 29.4,42.6 U5.2 ; M2.2 74.86,9.32 C73.1
  Top Layer w0.762: U56.2 U56.1 15.87,66.55 U1.79 ; U1.2 U1.1 15.91,23.33 U55.1
  Bottom Layer w0.762: H25.1 H25.2 H25.3
  vias: v1(1.14,22.78) v1(1.14,22.02) v1(1.14,9.45) v1(1.14,8.69) v1(1.91,22.78) v1(1.91,22.02) v1(1.91,9.45) v1(1.91,8.69) v1(2.79,75.74) v1(2.79,74.98) v1(2.79,67.87) v1(2.79,67.11) v1(3.56,75.74) v1(3.56,74.98) v1(3.56,67.87) v1(3.56,67.11) v1(10.41,75.74) v1(10.41,74.98) v1(11.18,75.74) v1(11.18,74.98) v1(11.3,96.57) v1(11.3,95.81) v1(12.06,96.57) v1(12.06,95.81) v1(16.64,85.52) v1(16.64,84.76) v1(17.4,85.52) v1(17.4,84.76) v1(22.35,97.21) v1(22.35,96.44) v1(23.11,97.21) v1(23.11,96.44) v1(25.78,10.72) v1(25.78,9.96) v1(26.54,10.72) v1(26.54,9.96) v1(27.18,86.79) v1(27.18,86.03) v1(27.94,86.79) v1(27.94,86.03) v1(28.7,92.38) v1(28.7,91.62) v1(28.96,97.33) v1(28.96,96.57) v1(29.46,92.38) v1(29.46,91.62) v1(29.72,97.33) v1(29.72,96.57) v1(33.4,87.43) v1(33.4,86.67) v1(34.16,87.43) v1(34.16,86.67) v1(34.54,17.7) v1(34.54,16.94) v1(35.31,17.7) v1(35.31,16.94) v1(35.69,93.02) v1(35.69,92.25) v1(36.45,93.02) v1(36.45,92.25) v1(41.53,92.51) v1(41.53,91.75) v1(42.29,92.51) v1(42.29,91.75) v1(46.1,89.46) v1(46.1,88.7) v1(46.86,89.46) v1(46.86,88.7) v1(49.66,89.46) v1(49.66,88.7) v1(49.91,6.91) v1(49.91,6.15) v1(49.91,2.34) v1(49.91,1.57) v1(50.42,89.46) v1(50.42,88.7) v1(50.67,6.91) v1(50.67,6.15) v1(50.67,2.34) v1(50.67,1.57) v1(57.28,19.99) v1(57.28,19.23) v1(57.53,15.67) v1(57.53,14.91) v1(58.04,19.99) v1(58.04,19.23) v1(58.29,15.67) v1(58.29,14.91) v1(59.69,95.17) v1(59.69,94.41) v1(60.45,95.17) v1(60.45,94.41) v1(67.31,18.47) v1(67.31,17.7) v1(67.82,75.62) v1(67.82,74.85) v1(67.82,10.59) v1(67.82,9.83) v1(67.88,93.75) v1(67.88,92.99) v1(68.07,18.47) v1(68.07,17.7) v1(68.64,93.75) v1(68.64,92.99) v1(68.58,75.62) v1(68.58,74.85) v1(68.58,10.59) v1(68.58,9.83) v1(72.64,11.48) v1(72.64,10.72) v1(72.77,3.99) v1(72.77,3.23) v1(73.41,11.48) v1(73.41,10.72) v1(73.53,3.99) v1(73.53,3.23) v1(77.6,95.68) v1(77.6,94.92) v1(77.72,77.78) v1(77.72,77.01) v1(78.36,95.68) v1(78.36,94.92) v1(78.49,77.78) v1(78.49,77.01) v1(79.25,29.9) v1(79.25,29.13) v1(79.38,36.37) v1(79.38,35.61) v1(79.76,16.81) v1(79.76,16.05) v1(79.76,12.5) v1(79.76,11.74) v1(80.01,29.9) v1(80.01,29.13) v1(80.14,36.37) v1(80.14,35.61) v1(80.52,16.81) v1(80.52,16.05) v1(80.52,12.5) v1(80.52,11.74) v1(80.77,43.87) v1(80.77,43.1) v1(81.28,69.39) v1(81.28,68.63) v1(81.53,43.87) v1(81.53,43.1) v1(82.04,69.39) v1(82.04,68.63) v1(84.46,95.68) v1(84.46,94.92) v1(85.22,95.68) v1(85.22,94.92) v1(86.36,69.39) v1(86.36,68.63) v1(86.49,4.75) v1(86.49,3.99) v1(86.87,89.2) v1(86.87,88.44) v1(87.12,69.39) v1(87.12,68.63) v1(87.25,4.75) v1(87.25,3.99) v1(87.63,89.2) v1(87.63,88.44) v1(88.77,83.11) v1(88.77,82.35) v1(89.53,83.11) v1(89.53,82.35) v1(92.2,69.39) v1(92.2,68.63) v1(92.2,19.23) v1(92.2,18.47) v1(92.84,1.7) v1(92.84,0.94) v1(92.96,69.39) v1(92.96,68.63) v1(92.96,19.23) v1(92.96,18.47) v1(93.6,90.47) v1(93.6,89.71) v1(93.6,1.7) v1(93.6,0.94) v1(94.36,90.47) v1(94.36,89.71) v1(95.63,47.42) v1(95.63,46.66) v1(95.63,42.72) v1(95.63,41.96) v1(96.39,47.42) v1(96.39,46.66) v1(96.39,42.72) v1(96.39,41.96) v1(98.3,47.42) v1(98.3,46.66) v1(98.3,42.72) v1(98.3,41.96) v1(99.06,47.42) v1(99.06,46.66) v1(99.06,42.72) v1(99.06,41.96)
PGND: length 53.4
  Top Layer w0.406: R91.2 14.02,56.12 Q4.2 12.32,56.14 v1(12.32,56.82) ; v1(12.32,61.01) 12.32,60.33 Q5.2 13.97,60.31 R93.2
  Top Layer w0.762: v4(79.58,22.66) R19.2 79.58,26.28 R89.2
  Bottom Layer w0.406: v1(12.32,61.01) v1(12.32,56.82) 12.32,36.37 11.05,35.1 CN6.4
  Bottom Layer w0.762: v4(79.58,22.66) v4(94.11,22.66)
  vias: v4(24.08,1.83) v4(24.08,0.81) v4(25.09,1.83) v4(25.09,0.81) v4(26.13,1.83) v4(26.13,0.81) v4(42.03,11.48) v4(42.03,10.47) v4(43.06,11.48) v4(43.06,10.47)
VCC: length 82.3
  Top Layer w1.016: CN6.3 8.76,37.64 10.54,35.86 10.54,19.86 11.68,18.72 v2(16.18,18.72)
  Bottom Layer w1.016: U41.2 60.63,3.94 50.42,14.15 44.92,14.15 U41.13 26.72,14.1 24.38,16.43 24.38,18.09 23.75,18.72 v2(18.55,18.72) v2(17.31,18.72) v2(16.18,18.72)
A00: length 52.2
  Top Layer w0.254: U41.10 44.87,6.86 46.1,8.09 46.1,10.08 45.85,10.34 44.45,10.34 43.43,9.32 40.77,9.32 38.61,11.48 38.61,19.74 36.45,21.9 18.92,21.9 18.41,22.41 U55.3 18.41,23.47 19.69,24.75 19.69,27.36 18.45,28.59 U1.3
A01: length 74
  Top Layer w0.254: U1.5 20.99,28.63 22.22,27.39 22.22,24.57 U55.5
  Bottom Layer w0.254: 65.62,11.56 63.63,13.56 63.63,19.1 66.29,21.77 66.29,27.36 64.77,28.88 21.72,28.88 20.95,29.64 20.95,30.91 U1.5
A02: length 110.9
  Top Layer w0.254: v1(31.12,54.28) 31.12,44.31 31.01,44.2 31.01,43.66 30.99,43.63 30.99,40.06 29.84,38.91 13.21,38.91 11.68,37.39 11.68,21.51 12.83,20.37 30.23,20.37 31.12,19.48 31.12,9.19 32.28,8.03 M1.3 ; U56.19 38.73,71.94 39.87,70.8 39.87,68.56 38.73,67.42 38.73,66.55 U1.61
  Bottom Layer w0.254: v1(31.12,54.28) 37.72,54.28 38.74,55.3 38.74,66.46 U1.61
A07: length 8.5
  Top Layer w0.254: U1.50 53.93,71.22 52.79,72.36 52.79,75.45 U56.32
A08: length 8.7
  Top Layer w0.254: U1.7 23.53,28.63 24.77,27.39 24.77,24.57 U55.7
A09: length 8.7
  Top Layer w0.254: U1.9 26.07,28.63 27.31,27.39 27.31,24.56 26.03,23.29 U55.9
A10: length 43.1
  Top Layer w0.254: U55.12 28.57,27.49 27.31,28.75 27.31,32.06 28.61,33.36 U1.12 28.5,33.61
  Bottom Layer w0.254: U55.12 28.57,25.83 27.31,24.56 27.31,22.28 26.67,21.64 14.86,21.64 13.46,20.24 13.46,11.61 17.27,7.8 17.27,6.58 D3.1
A11: length 50.8
  Top Layer w0.254: U1.14 31.15,32.62 29.97,31.44 29.97,28.88 31.15,27.7 31.15,25.87 U55.14
  Bottom Layer w0.254: U55.14 31.11,26.73 30.23,27.61 12.57,27.61 11.94,26.97 11.94,8.58 D6.1
A12: length 45
  Top Layer w0.254: v1(28.7,41.33) U5.1 ; U55.29 52.61,24.47 52.61,27.71 51.43,28.88 51.43,29.71 51.47,29.75 U1.29 51.47,31.33 52.71,32.56 v1(52.71,41.33)
  Bottom Layer w0.254: v1(52.71,41.33) v1(28.7,41.33)
A13: length 44.4
  Top Layer w0.254: v1(51.44,45.14) 51.47,45.1 U1.30 51.47,32.98 50.29,31.8 50.29,29.26 51.43,28.12 U55.30 ; v1(28.83,45.14) U5.4
  Bottom Layer w0.254: v1(51.44,45.14) v1(28.83,45.14)
A15: length 67.2
  Top Layer w0.254: U56.12 28.57,76.17 27.39,75 27.39,72.36 28.57,71.18 28.57,69.09 U1.70
  Bottom Layer w0.254: U56.12 28.57,78.41 30.99,80.82 30.99,90.09 32.64,91.75 32.64,95.56 33.27,96.19 57.78,96.19 59.31,97.71 67.94,97.71 68.32,97.33 CN7.3
A17: length 32.4
  Top Layer w0.254: U56.14 29.93,75.45 29.93,72.36 31.11,71.18 31.11,69.09 U1.68 ; ESP01S1.1 21.59,88.06 v1(31.88,88.06)
  Bottom Layer w0.254: U56.14 31.88,77.4 v1(31.88,88.06)
A18: length 54.5
  Top Layer w0.254: v1(58.8,85.01) 58.55,84.76 33.4,84.76 33.15,85.01 26.16,85.01 ESP01S1.8 ; U1.46 59.01,71.22 57.87,72.36 57.87,75.45 U56.36
  Bottom Layer w0.254: U56.36 58.8,76.88 v1(58.8,85.01)
A21: length 110.9
  Top Layer w0.254: M1.4 33.51,8.94 32.77,8.94 31.62,10.08 31.62,19.86 30.61,20.88 13.08,20.88 12.19,21.77 12.19,37.26 13.46,38.53 30.1,38.53 31.88,40.31 v1(31.88,55.3) ; U1.64 36.19,69.09 36.19,71.18 35.01,72.36 35.01,75.45 U56.18
  Bottom Layer w0.254: U1.64 34.93,67.83 34.93,56.31 33.91,55.3 v1(31.88,55.3)
A22: length 123.1
  Top Layer w0.254: U1.72 26.03,69.09 26.03,71.18 24.85,72.36 24.85,75.45 U56.10 ; 44.87,9.02 44.41,8.56 40.77,8.56 38.1,11.23 38.1,19.35 36.07,21.39 13.46,21.39 12.68,22.17 12.68,36.99 13.84,38.15 30.35,38.15 32.64,40.44 32.64,56.06 30.1,58.6 v2(24.77,58.6)
  Bottom Layer w0.254: U1.72 24.77,67.83 v2(24.77,58.6)
A23: length 53.3
  Top Layer w0.254: U1.62 38.73,69.09 38.73,71.18 37.55,72.36 37.55,75.45 U56.20 ; CN9.3 14.61,93.9 38.74,93.9 40.13,92.51 v1(40.13,86.28)
  Bottom Layer w0.254: U56.20 38.73,78.79 40.13,80.19 v1(40.13,86.28)
A24: length 64.1
  Top Layer w0.254: v1(20.83,79.81) 21.59,79.05 30.35,79.05 34.42,83.11 65.41,83.11 65.77,83.47 CN3.4 ; U1.76 20.95,69.09 20.95,71.18 19.77,72.36 19.77,74.81 20.95,75.99 U56.6
  Bottom Layer w0.254: U56.6 20.95,79.69 v1(20.83,79.81)
A25: length 70.4
  Top Layer w0.254: CN3.3 68.27,84.83 66.04,82.6 34.54,82.6 30.61,78.66 19.18,78.66 v1(18.8,79.05) ; U56.5 20.95,71.94 22.09,70.8 22.09,67.69 U1.75
  Bottom Layer w0.254: U56.5 19.69,75.36 19.69,78.16 v1(18.8,79.05)
A26: length 67.8
  Top Layer w0.254: U1.78 18.41,69.09 18.41,71.18 17.23,72.36 17.23,75.1 18.41,76.28 U56.4 18.41,77.26 19.43,78.28 30.86,78.28 34.67,82.09 66.17,82.09 69.47,85.39 69.98,85.39 70.77,86.18 CN3.2
A27: length 72.3
  Top Layer w0.254: CN3.1 73.27,85.76 72.39,84.89 69.85,84.89 66.55,81.58 34.8,81.58 31.12,77.9 20.32,77.9 19.69,77.27 19.69,75.58 18.41,74.3 U56.3 18.41,71.94 19.55,70.8 19.55,67.69 U1.77
A28: length 183.4
  Top Layer w0.254: H20.4 96.14,78.03 93.85,78.03 90.35,74.52 R21.1 88.98,74.52 88.7,74.8 88.7,78.87 85.98,81.58 JY901I2C1.4 80.65,81.58 79.76,82.47 79.76,90.22 78.1,91.87 54.86,91.87 52.58,94.16 52.58,96.19 TOF/IIC.4 ; U1.4 17.14,32.18 17.14,28.5 18.48,27.17 18.48,25.9 U55.4
  Bottom Layer w0.254: JY901I2C1.4 77.22,81.58 75.56,79.93 75.56,38.91 73.41,36.75 19.56,36.75 18.45,35.65 U1.4
A29: length 71.5
  Top Layer w0.254: U1.34 56.55,32.98 55.37,31.8 55.37,29.26 56.51,28.12 U55.34
  Bottom Layer w0.254: U55.34 55.25,24.57 55.25,21.13 54.74,20.62 15.88,20.62 14.48,19.23 14.48,14.45 D1.1
A30: length 101.4
  Top Layer w0.254: U56.27 48.89,71.94 50.03,70.8 50.03,67.69 U1.53 48.85,63.12 46.86,61.14 41.28,61.14 40.64,60.5 40.64,38.15 38.99,36.5 15.37,36.5 13.33,34.47 v1(13.33,25.83)
  Bottom Layer w0.254: D4.1 14.88,6.89 12.95,8.81 12.95,25.45 v1(13.33,25.83)
A31: length 187.2
  Top Layer w0.254: U1.6 19.69,32.18 19.69,28.63 20.95,27.36 U55.6 ; H20.3 97.41,76.89 96.01,75.49 93.47,75.49 92.71,74.73 92.71,73.33 92.02,72.64 87.12,72.64 86.74,73.02 R20.1 87.14,74.49 88.14,75.49 88.14,78.54 87.63,79.05 JY901I2C1.3 80.26,79.05 79.25,80.06 79.25,89.97 77.72,91.49 51.82,91.49 50.04,93.27 50.04,96.19 TOF/IIC.3
  Bottom Layer w0.254: U1.6 20.99,34.69 20.95,34.72 20.95,34.98 22.22,36.25 73.53,36.25 76.07,38.79 76.07,78.28 76.84,79.05 JY901I2C1.3
ADC5: length 62.8
  Top Layer w0.254: U56.7 23.49,71.94 24.63,70.8 24.63,67.69 U1.73 ; v1(22.29,80) 22.86,79.43 30.1,79.43 34.29,83.62 62.74,83.62 63.27,84.14 CN3.5
  Bottom Layer w0.254: v1(22.29,80) 22.29,79.89 22.22,79.83 22.22,75.23 23.36,74.09 U56.7
ADC6: length 55.9
  Top Layer w0.254: U56.8 23.49,76.07 22.31,74.89 22.31,72.36 23.49,71.18 23.49,69.09 U1.74 ; CN3.6 60.77,84.44 60.45,84.12 34.16,84.12 29.84,79.81 24,79.81 v1(23.5,80.31)
  Bottom Layer w0.254: v1(23.5,80.31) 23.5,76.64 U56.8
ADC_VIN: length 2.2
  Top Layer w0.254: R1.2 93.84,36.09 R5.2
AO1: length 8.4
  Top Layer w0.762: M1.6 39.78,4.6 40.44,3.94 U41.9
AO2: length 21.2
  Top Layer w0.762: M1.1 27.28,5.92 31.8,1.4 44.87,1.4
B00: length 30.6
  Top Layer w0.254: U56.29 51.43,71.94 52.57,70.8 52.57,67.69 U1.51
  Bottom Layer w0.254: TOF/UART.4 51.27,79.34 52.71,77.9 52.71,75.37 U56.29
B01: length 28.1
  Top Layer w0.254: U56.30 51.43,75.76 50.25,74.58 50.25,72.36 51.43,71.18 51.43,69.09 U1.52
  Bottom Layer w0.254: U56.30 51.43,77.53 48.73,80.23 TOF/UART.3
B02: length 8.6
  Top Layer w0.254: U1.15 33.69,28.59 34.83,27.45 34.83,24.47 U55.15
B03: length 8.6
  Top Layer w0.254: U1.17 36.23,28.72 37.37,27.58 37.37,24.47 U55.17
B04: length 41.3
  Top Layer w0.254: U55.8 23.49,27.36 22.22,28.63 22.22,32.18 U1.8
  Bottom Layer w0.254: D5.1 12.33,26.61 12.95,27.23 22.84,27.23 23.49,26.58 U55.8
B05: length 8.6
  Top Layer w0.254: U1.10 26.07,33.36 24.89,32.18 24.89,28.63 26.03,27.49 U55.10
B06: length 8.6
  Top Layer w0.254: U1.25 46.39,28.84 47.53,27.71 47.53,24.47 U55.25
B07: length 101.9
  Top Layer w0.254: v1(46.35,38.53) 46.39,38.5 U1.26 46.39,32.98 45.21,31.8 45.21,29.26 46.39,28.08 46.39,25.87 U55.26
  Bottom Layer w0.254: CN7.2 70.87,96.02 70.87,94.41 72.01,93.27 74.29,93.27 74.8,92.76 74.8,81.08 74.42,80.7 74.42,39.42 73.53,38.53 v1(46.35,38.53)
B08: length 8.6
  Top Layer w0.254: U1.27 48.93,28.84 50.07,27.71 50.07,24.47 U55.27
B09: length 8.7
  Top Layer w0.254: U55.28 48.93,25.87 48.93,28.08 47.75,29.26 47.75,31.8 48.93,32.98 U1.28
B10: length 8.7
  Top Layer w0.254: U56.31 53.97,71.94 55.25,70.66 55.25,68.5 53.93,67.19 U1.49
B11: length 8.5
  Top Layer w0.254: U56.33 56.51,71.94 57.65,70.8 57.65,67.69 U1.47
B12: length 8.7
  Top Layer w0.254: U55.16 33.69,25.87 33.69,27.96 32.51,29.13 32.51,31.44 33.69,32.62 U1.16
B13: length 61.1
  Top Layer w0.254: U1.18 36.23,32.98 35.05,31.8 35.05,29.26 36.23,28.08 36.23,25.87 U55.18
  Bottom Layer w0.254: 65.62,9.02 63.25,11.4 63.25,19.35 65.79,21.9 65.79,27.23 64.64,28.37 36.96,28.37 36.19,27.6 U55.18
B14: length 89.2
  Top Layer w0.254: U56.34 55.33,75.45 55.33,72.36 56.47,71.22 U1.48 56.47,68.84 55.29,67.66 55.29,64.9 56.39,63.81 56.39,40.94 57.02,40.31 72.9,40.31 76.2,37.01 v1(76.2,31.67)
  Bottom Layer w0.254: v1(76.2,31.67) 76.2,11.99 78.21,9.98 M2.4
B15: length 78.2
  Top Layer w0.254: U1.11 28.61,27.95 29.75,26.81 29.75,24.47 U55.11
  Bottom Layer w0.254: U1.11 28.57,30.91 28.57,29.64 28.83,29.39 74.55,29.39 75.71,28.22 M2.3
B16: length 8.6
  Top Layer w0.254: U55.13 32.29,24.47 32.29,27.32 31.15,28.46 U1.13
B17: length 76.1
  Top Layer w0.254: v1(40.23,62.19) 36.29,62.19 33.78,64.69 33.78,66.34 U1.65 33.65,66.55 33.65,66.76 34.79,67.9 34.79,70.8 33.65,71.94 U56.15 ; KEY1.1 91.37,66.22 68.47,66.22 66.82,64.57 v1(59.69,64.57)
  Bottom Layer w0.254: v1(59.69,64.57) 59.69,63.42 58.45,62.19 v1(40.23,62.19)
B18: length 84.1
  Top Layer w0.254: v1(58.42,63.93) 58.44,63.91 67.04,63.91 68.83,65.71 91.06,65.71 93.09,63.68 93.09,60.31 KEY2.1 ; v1(43.18,63.68) 40.89,61.39 35.18,61.39 32.38,64.19 32.38,67.74 33.61,68.97 U1.66 33.65,69.09 33.65,71.18 32.47,72.36 32.47,75.45 U56.16
  Bottom Layer w0.254: v1(58.42,63.93) 43.43,63.93 v1(43.18,63.68)
B19: length 78.3
  Top Layer w0.254: v1(41.21,62.98) 38.54,62.98 36.15,65.37 U1.63 37.33,67.69 37.33,70.8 36.19,71.94 U56.17 ; v1(57.53,63.04) 67.18,63.04 69.22,65.08 90.81,65.08 92.46,63.42 92.46,60.12 93.39,59.19 93.39,55.82 KEY3.1
  Bottom Layer w0.254: v1(41.21,62.98) 57.47,62.98 v1(57.53,63.04)
B20: length 84.9
  Top Layer w0.254: U56.9 26.03,71.94 27.17,70.8 27.17,67.69 U1.71
  Bottom Layer w0.254: U56.9 24.77,75.36 24.77,98.09 26.03,99.37 72.39,99.37 73.33,98.43 CN7.1
B21: length 103.7
  Top Layer w0.254: R23.1 21.83,17.07 10.41,17.07 9.4,18.09 v1(9.4,32.31) ; U1.55 46.35,66.55 46.35,66.86 47.49,68 47.49,70.8 46.35,71.94 U56.25
  Bottom Layer w0.254: v1(9.4,32.31) 13.08,32.31 14.1,33.33 14.1,48.82 16.13,50.85 38.48,50.85 39.62,51.99 39.62,62.66 41.53,64.57 45.59,64.57 46.31,65.28 U1.55
B22: length 28
  Top Layer w0.254: v1(36.06,80.57) 36.07,80.56 36.07,79.3 36.7,78.66 45.72,78.66 46.35,78.03 46.35,76.64 U56.26 45.17,75.45 45.17,72.36 46.35,71.18 46.35,69.09 U1.56 ; 36.06,86.54 v1(36.06,85.39)
  Bottom Layer w0.254: v1(36.06,85.39) v1(36.06,80.57)
B23: length 8.7
  Top Layer w0.254: U1.31 54.01,28.72 55.25,27.48 55.25,24.57 U55.31
B26: length 68.6
  Top Layer w0.254: U1.32 54.01,32.73 52.83,31.55 52.83,29.26 53.97,28.12 U55.32
  Bottom Layer w0.254: D2.1 19.95,7.66 13.97,13.64 13.97,19.61 15.49,21.13 52.2,21.13 52.71,21.64 52.71,24.69 53.85,25.83 U55.32
B27: length 97.2
  Top Layer w0.254: U55.33 57.69,24.47 57.69,27.71 56.55,28.84 U1.33 56.55,31.33 57.78,32.56 57.78,34.47 56.64,35.61 v1(56.64,37.64)
  Bottom Layer w0.254: CN10.3 84.96,90.09 84.2,89.33 77.22,89.33 76.96,89.08 76.96,82.35 74.93,80.31 74.93,39.04 73.15,37.26 57.02,37.26 v1(56.64,37.64)
BO1: length 22.6
  Top Layer w0.762: M2.6 82.3,8.59 82.3,12.62 80.82,14.1 U41.6
BO2: length 11.1
  Bottom Layer w0.762: U41.7 70.71,11.55 M2.1
CANH: length 22.2
  Top Layer w0.254: CN6.2 8.69,41.25 18.21,41.25 19.56,42.6 U5.7 24,42.6 25.15,43.74 25.15,46.5 R8.2
CANL: length 22.2
  Top Layer w0.254: CN6.1 8.69,41.66 17.86,41.66 20.07,43.87 U5.6 22.86,43.87 23.37,43.36 24,43.36 24.64,43.99 24.64,45.55 23.49,46.7 R8.1
CHIP: length 8.6
  Top Layer w0.254: U1.36 59.09,32.98 57.91,31.8 57.91,29.26 59.05,28.12 U55.36
CLK: length 8.7
  Top Layer w0.254: U1.20 38.77,32.98 37.59,31.8 37.59,29.26 38.77,28.08 38.77,25.87 U55.20
DIO: length 8.6
  Top Layer w0.254: U1.19 38.77,28.84 39.91,27.71 39.91,24.47 U55.19
FB1: length 10.6
  Top Layer w0.254: U4.4 84.46,42.93 84.46,36.12 R6.1
  Top Layer w0.508: R7.2 R6.1
P_EN: length 6.3
  Top Layer w0.508: R17.1 82.61,26.03 C32.2 82.31,27.89 R16.2 82.32,29.5 R18.1
P_EN1: length 7.6
  Top Layer w0.305: R18.2 84.81,31.64 85.6,32.44 85.6,38.29 U4.5
RST: length 8.5
  Top Layer w0.254: U1.45 60.19,67.69 60.19,70.8 59.05,71.94 U56.35
$1N1656: length 16.9
  Top Layer w0.305: 92.33,47.8 92.46,47.67 92.46,40.82 92.01,40.37 C9.2 89.28,38.6 U4.8
  Top Layer w0.762: 92.33,47.8 91.6,47.07 U51.2
$1N1657: length 2.9
  Top Layer w0.305: U4.1 89.28,43.55 C9.1
$1N1908: length 2.9
  Top Layer w0.406: PWR.2 90.06,58.67 R24.1
$1N4369: length 2
  Top Layer w0.508: Q3.1 23.3,13.59 R23.2
$1N4372: length 6
  Top Layer w0.508: Q3.2 18.39,12.77 17.4,13.77 17.4,15.15 BUZZER1.2
$1N7155: length 4.1
  Top Layer w0.406: Q4.1 15.99,54.22 R90.1
$1N7448: length 8.3
  Top Layer w0.406: Q4.3 10.3,53.8 U52.2 7.86,51.36 6.22,51.36 5.08,52.5 5VS1.1
$1N7843: length 4
  Top Layer w0.406: Q5.1 14.07,58.41 R93.1 R92.1
$1N7851: length 8.4
  Top Layer w0.406: 5VS2.1 5.08,63.04 7.51,63.04 U54.2 10.3,60.98 Q5.3
$1N10841: length 2.3
  Top Layer w0.406: 38.26,86.54 38.26,88.77 R94.1

## Copper pours and planes (outline as drawn; the poured copper is in the pictures)
GND on Top Layer: -70.87,157.02 112.14,157.02 112.14,-17.22 -70.87,-17.22
GND on Bottom Layer: -4.83,106.22 145.54,106.22 145.54,-37.54 -4.83,-37.54
PGND on Top Layer: 6.73,2.34 26.8,2.34 26.8,0.31 6.73,0.31
PGND on Top Layer: 41.4,24.44 99.69,24.44 99.69,0.56 41.4,0.56
PGND on Top Layer: 41.4,17.7 43.69,17.7 43.69,9.96 41.4,9.96
PGND on Top Layer: 5.59,36.12 8.89,36.12 8.89,0.31 5.59,0.31
PGND on Bottom Layer: 23.5,12.12 43.69,12.12 43.69,0.31 23.5,0.31
VCC on Top Layer: 83.57,39.67 92.58,39.67 92.58,18.47 83.57,18.47
VCC on Top Layer: 60.32,22.28 88.01,22.28 88.01,3.1 60.32,3.1
VCC on Top Layer: 15.62,19.23 19.05,19.23 19.05,18.21 15.62,18.21
VCC on Bottom Layer: 15.62,19.23 19.05,19.23 19.05,18.21 15.62,18.21
VIN_SW on Top Layer: 83.69,16.43 97.16,16.43 97.16,9.19 83.69,9.19

Small or netless copper shapes (teardrops, artwork), in the pictures only: 403 on Top Layer, 161 on Bottom Layer

## Text on the board
Top Silkscreen Layer: DIN2 | GND | 3V3 | A28 | A00 | A31 | A01 | B04 | A08 | B05 | A09 | A10 | B15 | A11 | B16 | B12 | B02 | B13 | B03 | B21 | DIO | 5V | B07 | B06 | B09 | B08 | A13 | A12 | B26 | B23 | A29 | B27 | CHIP | AG | VCC | H | L | B01 | B00 | A15 | B20 | A18 | A26 | A27 | A24 | A25 | B24 | B25 | A22 | A14 | A17 | A16 | B18 | B17 | A21 | B19 | A23 | A02 | B22 | A30 | A07 | B10 | B14 | B11 | RST | A1 | A2 | A3 | A4 | A5 | A6 | ON | OFF | + | - | ZZY
